# Altium schematic sheet QSPI.SchDoc: QSPI
size A4; Date: 9/24/2014; Author: P.A.; CompanyName: STMicroelectronics; Organization: Microcontrollers Division; Address1: 12, Rue Jules HOROWITZ; Address2: 38019 Grenoble; Address3: FRANCE; DocumentNumber: MB1189; Revision: B-07; SheetNumber: 9; SheetTotal: 12; Project: STM32F469I-DISCO
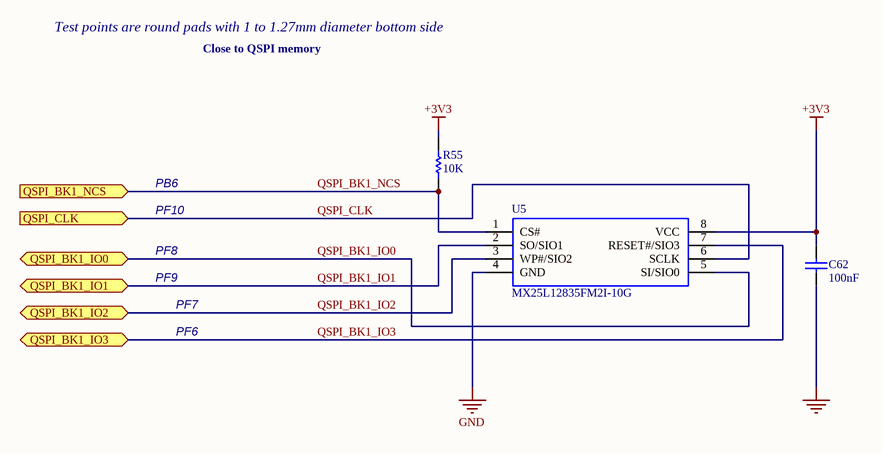
[diagram p0: QSPI.SchDoc]

## Parts
C62  100nF  [CAP - 0402]
R55  10K  [RES - 0402]
U5  MX25L12835FM2I-10G  [SOIC127P790X216-8N]

## Ports
QSPI_BK1_IO0 (bidir), QSPI_BK1_IO1 (bidir), QSPI_BK1_IO2 (bidir), QSPI_BK1_IO3 (bidir), QSPI_BK1_NCS (in), QSPI_CLK (in)

## Nets
+3V3: C62.1 R55.2 U5.8(VCC)
GND: C62.2 U5.4(GND)
QSPI_BK1_IO0: U5.5(SI/SIO0) ; port QSPI_BK1_IO0
QSPI_BK1_IO1: U5.2(SO/SIO1) ; port QSPI_BK1_IO1
QSPI_BK1_IO2: U5.3(WP#/SIO2) ; port QSPI_BK1_IO2
QSPI_BK1_IO3: U5.7(RESET#/SIO3) ; port QSPI_BK1_IO3
QSPI_BK1_NCS: R55.1 U5.1(CS#) ; port QSPI_BK1_NCS
QSPI_CLK: U5.6(SCLK) ; port QSPI_CLK

## Notes on the sheet
- Test points are round pads with 1 to 1.27mm diameter bottom side
- Close to QSPI memory
- PB6
- PF10
- PF8
- PF9
- PF7
- PF6
- Title:
- Project:
- Size:
- Date:
- A4
- Reference:
- Sheet:
- Revision:
- of

## Library data of the parts
C62 = Cap: Capacitor; Value: 10nF; Ordered by: Subcon; Published: 8-Jun-2000; Revision: July-2002: Re-released for DXP Platform.; Publisher: Altium Limited
R55 = Res_10K_1%_0402: Resistor; Manuf_Part_1: RC0402FR-0710KL; Manuf_1: YAGEO; Ordered by: Subcon; Value: 10K; Order: RC0402FR-0710KL; ECCN_US/EU: n/a
U5 = MX25L12835FM2I-10G: Macronix MX25L12835FM2I-10G 128Mbit Flash Memory; 3V, SOP, 8-Pin; Geometry.Height: 2.16mm; Manufacturer_Name: Macronix; Manufacturer_Part_Number: MX25L12835FM2I-10G; RS Part Number: 1703072; RS Price/Stock: http://uk.rs-online.com/web/p/products/1703072; Arrow Part Number: MX25L12835FM2I-10G; Arrow Price/Stock: https://www.arrow.com/en/products/mx25l12835fm2i-10g/macronix-international; Datasheet Link: http://www.macronix.com/Lists/Datasheet/Attachments/6710/MX25L12835F,%203V,%20128Mb,%20v1.6.pdf